# EasyEDA Pro project c4主板.epro

# Schematic Schematic2
Create Date: 2024-11-27; Page Name: P1; Project Name: C4主板优化v3.1; Schematic Name: Schematic2; Update Date: 2025-04-03; Company: 嘉立创EDA; Page Size: A4; Version: V1.0
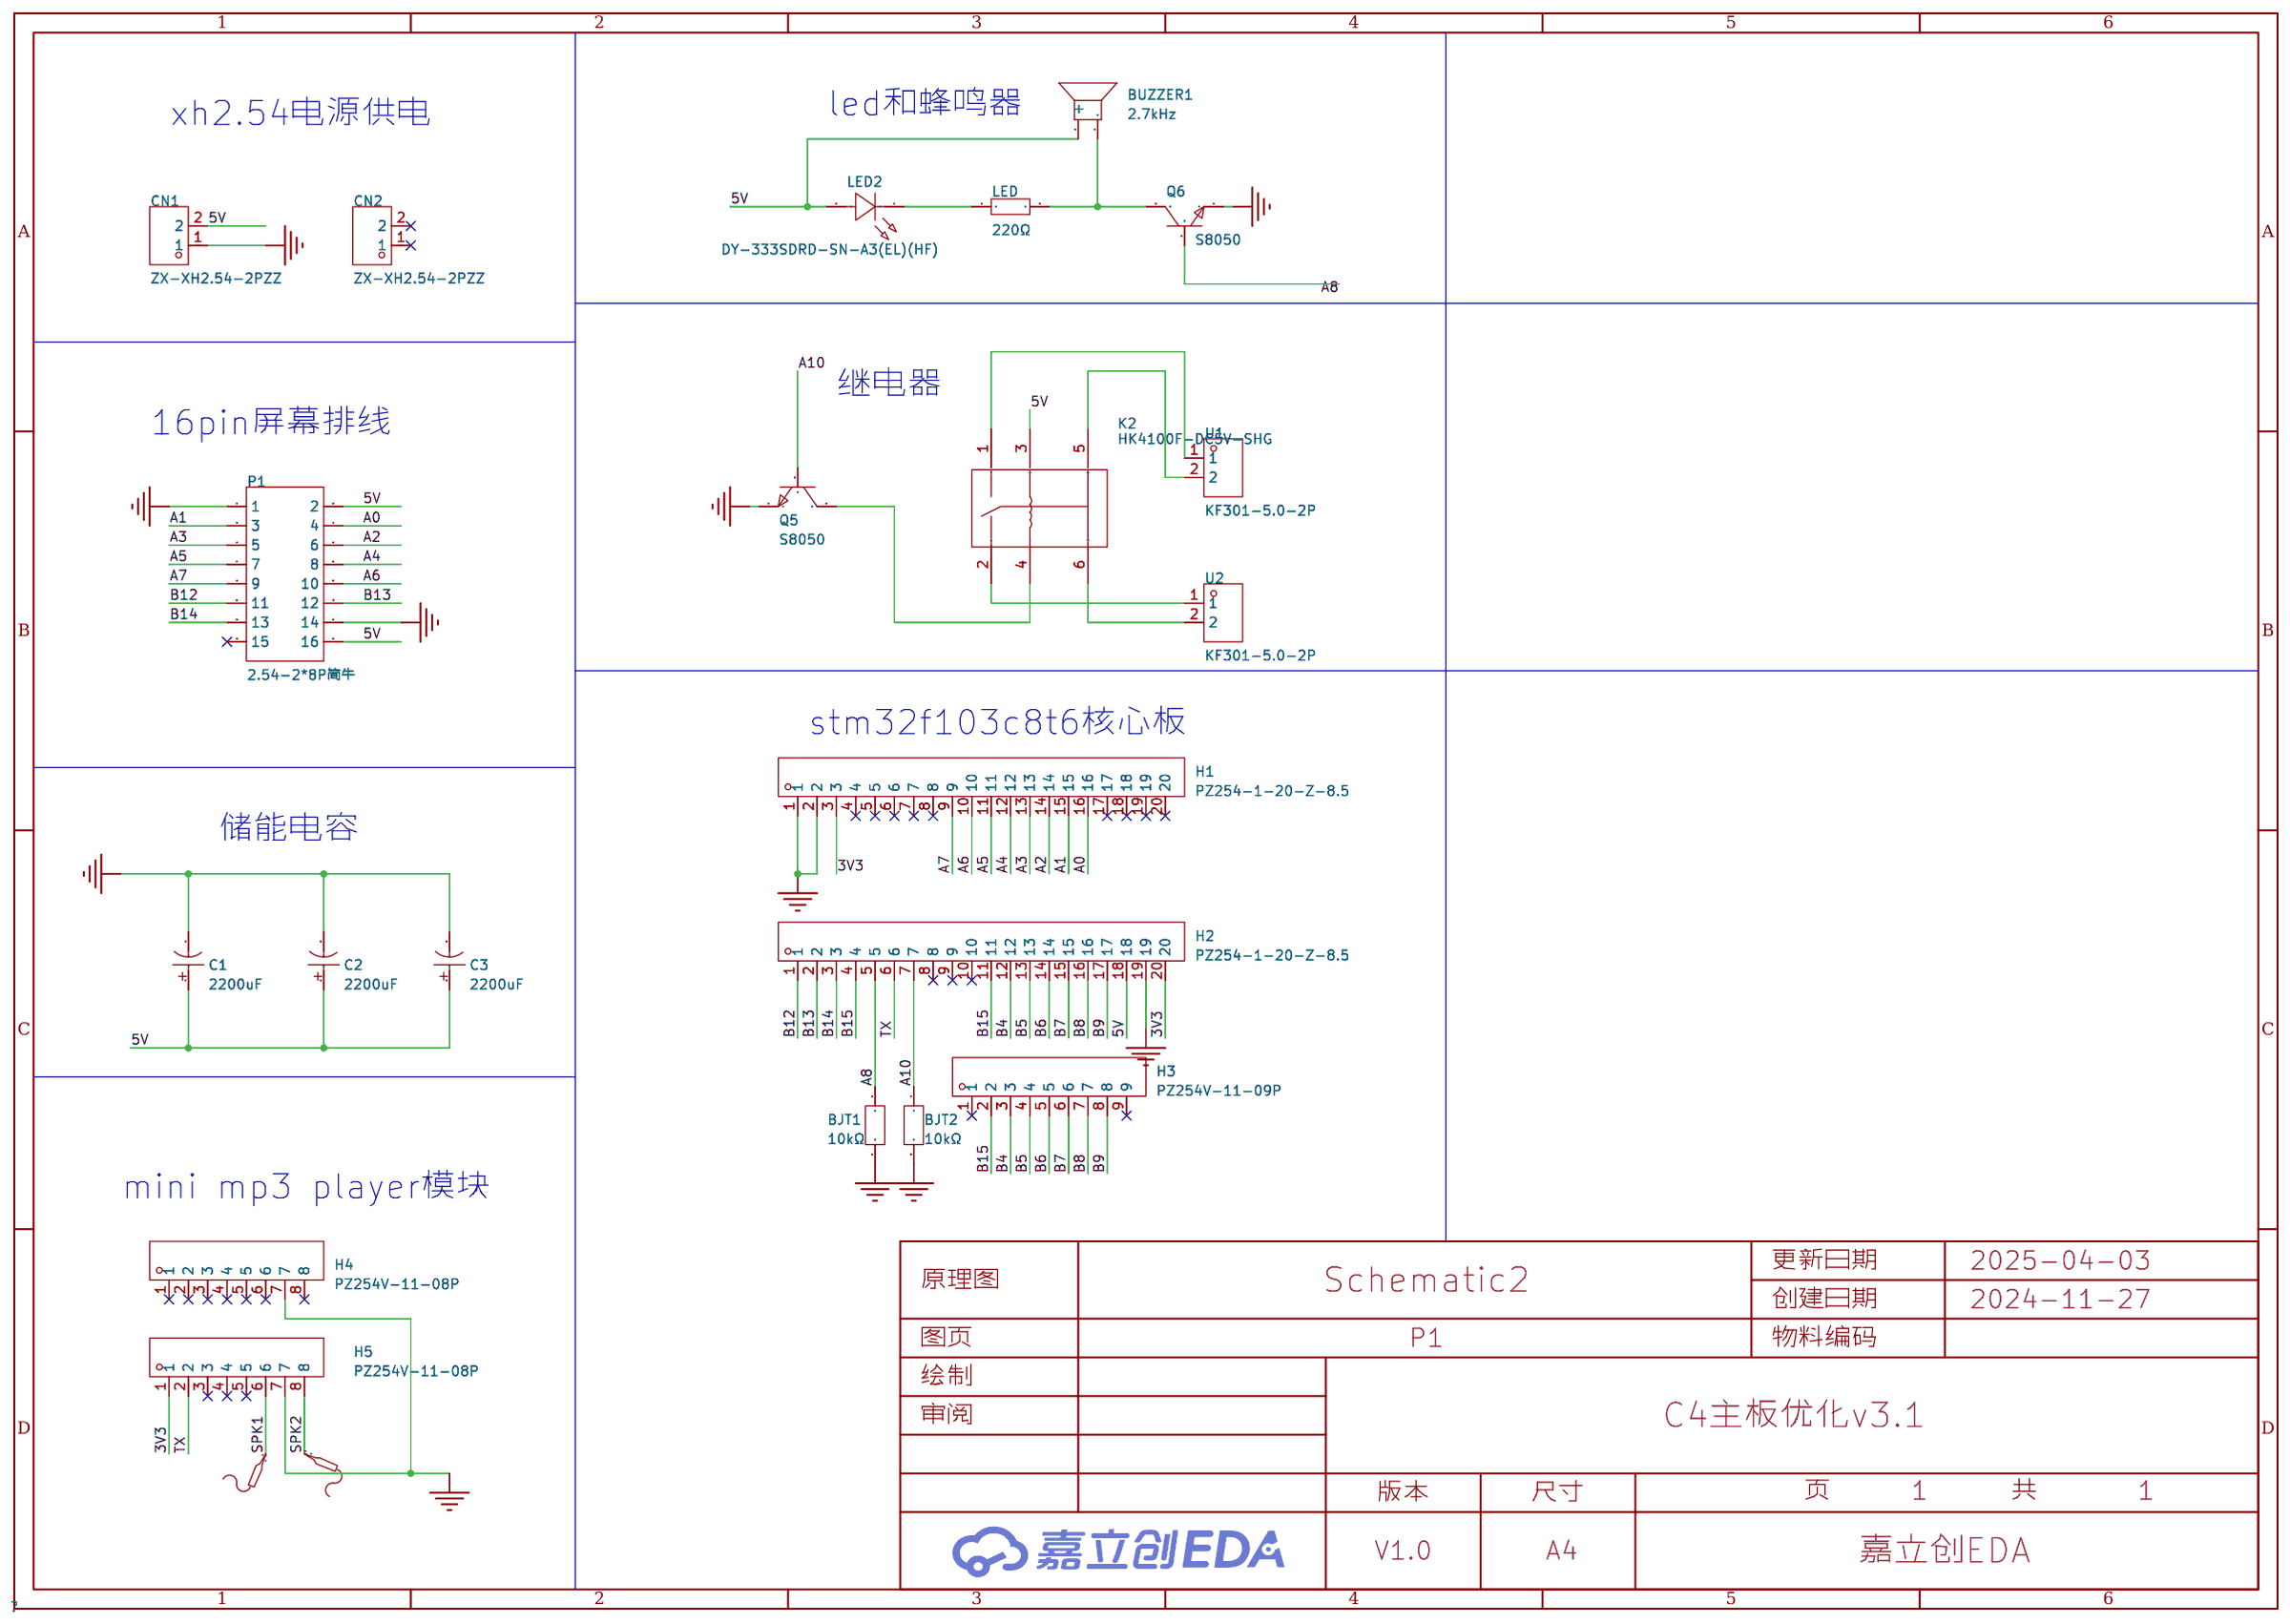
[diagram p0: schematic sheet]

## Parts
BJT1  10kΩ  [RES-TH_BD2.7-L6.2-P10.20-D0.4]
BJT2  10kΩ  [RES-TH_BD2.7-L6.2-P10.20-D0.4]
BUZZER1  2.7kHz  [BUZ-TH_BD12.0-P7.60-D0.6-FD]
C1  2200uF  [CAP-TH_BD10.0-P5.00-D1.0-FD]
C2  2200uF  [CAP-TH_BD10.0-P5.00-D1.0-FD]
C3  2200uF  [CAP-TH_BD10.0-P5.00-D1.0-FD]
CN1  ZX-XH2.54-2PZZ  [CONN-TH_2P-P2.50_HX25003-2A]
CN2  ZX-XH2.54-2PZZ  [CONN-TH_2P-P2.50_HX25003-2A]
H1  PZ254-1-20-Z-8.5  [HDR-TH_20P-P2.54-V-M]
H2  PZ254-1-20-Z-8.5  [HDR-TH_20P-P2.54-V-M]
H3  PZ254V-11-09P  [HDR-TH_9P-P2.54-V-M]
H4  PZ254V-11-08P  [HDR-TH_8P-P2.54-V-M]
H5  PZ254V-11-08P  [HDR-TH_8P-P2.54-V-M]
K2  HK4100F-DC5V-SHG  [RELAY-TH_HK4100F-DC5V-SHG]
LED  220Ω  [RES-TH_BD2.4-L6.3-P10.30-D0.6]
LED2  DY-333SDRD-SN-A3(EL)(HF)  [LED-TH_BD5.9-P2.54-RD]
P1  2.54-2*8P简牛  [IDC-TH_16P-P2.54_C3406]
Q5  S8050  [TO-92-3_L4.5-W3.5-P1.27-L]
Q6  S8050  [TO-92-3_L4.5-W3.5-P1.27-L]
SPK1  -  [Test-Point-0.5mm]
SPK2  -  [Test-Point-0.5mm]
U1  KF301-5.0-2P  [CONN-TH_P5.00_KF301-5.0-2P]
U2  KF301-5.0-2P  [CONN-TH_P5.00_KF301-5.0-2P]

## Library data of the parts
BJT1 BJT2 = MF1/4W-10K±1%-ST52: 电阻类型:金属膜电阻;阻值:10kΩ;精度:±1%;功率:250mW;温度系数:±100ppm/℃;; LCSC Part Name: 金属膜电阻 10kΩ ±1% 250mW; Supplier Part: C2903232; Manufacturer: VO(翔胜); Supplier Footprint: 插件,D2.7xL6.2mm; JLCPCB Part Class: 扩展库; Datasheet: https://atta.szlcsc.com/upload/public/pdf/source/20200609/C601728_5AA4C0C8E12E11069DA2C3356F29D1F2.pdf; Supplier: LCSC; Type: 金属膜电阻; Tolerance: ±1%; Overload Voltage (Max): 250V; Power(Watts): 250mW; Temperature Coefficient: ±100ppm/℃; Operating Temperature Range: -55℃~+155℃
BUZZER1 = TMB12A05_C96093: 驱动方式:有源(内含驱动线路);构造类型:电磁式;频率:2.7kHz;声压(SPL):85dB@5V,10cm;; LCSC Part Name: TMB12A05; Supplier Part: C96093; Manufacturer: 华能; Manufacturer Part: TMB12A05; Supplier Footprint: 插件,D=12mm; Datasheet: https://atta.szlcsc.com/upload/public/pdf/source/20230426/A4FC10532558AA232D532AB83455FBA4.pdf; Supplier: LCSC; Oscillator Circuit: 有源(内含驱动线路); Technology Type: 电磁式; Operating Voltage: 4V~8V; Sound Pressure Level (SPL): 85dB@5V,10cm; Diameter (φD): 12mm; Height: 9.8mm
C1-C3 = KM228M016G20RR0VH2FP0: 容值:2200uF;精度:±20%;额定电压:16V;纹波电流:-;等效串联电阻:-;; LCSC Part Name: 2200uF ±20% 16V; Supplier Part: C3328; Manufacturer: CX(承兴); Supplier Footprint: 插件,D10xL20mm; JLCPCB Part Class: 扩展库; Datasheet: https://atta.szlcsc.com/upload/public/pdf/source/20211027/06D6BA3719C264B639DC286D935D03EA.pdf; Supplier: LCSC; Tolerance: ±20%; Rated Voltage: 16V; Lead Spacing: 5mm; φD: 10mm; L: 20mm; Lifetime @ Temp: 2000hrs@105℃
CN1 CN2 = ZX-XH2.54-2PZZ: 插针结构:1x2P;间距:2.54mm;安装方式:直插;参考系列:XH;总PIN数:2P;排数:1;每排PIN数:2;行距:-;额定电流:3A;触头材质:黄铜;触头镀层:锡;工作温度范围:-25℃~+85℃;; Supplier Part: C7429632; Manufacturer: Megastar(兆星); Supplier Footprint: 插件,P=2.54mm; JLCPCB Part Class: 扩展库; Datasheet: https://atta.szlcsc.com/upload/public/pdf/source/20230619/19BA6947230AA44A04D3EDD65E618FD0.pdf; Supplier: LCSC; Pins Structure: 1x2P; Pitch: 2.54mm; Mounting Style: 直插; Reference Series: XH; Number of Pins: 2P; Number of Rows: 1; Number of PINs Per Row: 2; Current Rating (Max): 3A; Contact Material: 黄铜; Contact Plating: 锡; Operating Temperature Range: -25℃~+85℃
H1 H2 = PZ254-1-20-Z-8.5_C2894943: 插针结构:1x20P;间距:2.54mm;行距:-;圆针/方针:方针;安装类型:直插;排数:单排;总PIN位数:20P;额定电流:3A;额定电压:-;配合针长度:6mm;塑高:2.5mm;端接针长度:3mm;触头材质:-;工作温度范围:-40℃~+105℃;颜色:黑色;; LCSC Part Name: 间距:2.54mm 1x20P 直插 方针; Supplier Part: C2894943; Manufacturer: HCTL(华灿天禄); Supplier Footprint: 插件,P=2.54mm; Datasheet: https://atta.szlcsc.com/upload/public/pdf/source/20230609/805D25CEF03592837AF6F506EEB5ED41.pdf; Supplier: LCSC; Pin Structure: 1x20P; Pitch: 2.54mm; Circluar Pins/Square Pins: 方针; Mounting Type: 直插; Number of Rows: 单排; Number of Pins: 20P; Current Rating (Max): 3A; Length of Mating Pin: 6mm; Insulation Height: 2.5mm; Length of End Connection Pin: 3mm; Operating Temperature Range: -40℃~+105℃; Color: 黑色
H3 = PZ254V-11-09P: 插针结构:1x9P;间距:2.54mm;行距:-;圆针/方针:方针;安装类型:直插;排数:单排;总PIN位数:9P;额定电流:-;额定电压:-;配合针长度:6mm;塑高:2.5mm;端接针长度:3mm;触头材质:黄铜;触头镀层:-;工作温度范围:-40℃~+105℃;颜色:黑色;; LCSC Part Name: 间距:2.54mm 1x9P 直插 方针; Supplier Part: C492408; Manufacturer: XFCN(兴飞); Supplier Footprint: 插件,P=2.54mm; Datasheet: https://atta.szlcsc.com/upload/public/pdf/source/20200309/C492408_0CE6AEE885DD471CEFA4BE32B6482CF7.pdf; Supplier: LCSC; Pin Structure: 1x9P; Pitch: 2.54mm; Circluar Pins/Square Pins: 方针; Mounting Type: 直插; Number of Rows: 单排; Number of Pins: 9P; Length of Mating Pin: 6mm; Insulation Height: 2.5mm; Length of End Connection Pin: 3mm; Contact Material: 黄铜; Operating Temperature Range: -40℃~+105℃; Color: 黑色
H4 H5 = PZ254V-11-08P: 插针结构:1x8P;间距:2.54mm;行距:-;圆针/方针:方针;安装类型:直插;排数:单排;总PIN位数:8P;额定电流:-;额定电压:-;配合针长度:6mm;塑高:2.5mm;端接针长度:3mm;触头材质:黄铜;触头镀层:-;工作温度范围:-40℃~+105℃;颜色:黑色;; LCSC Part Name: 间距:2.54mm 1x8P 直插 方针; Supplier Part: C492407; Manufacturer: XFCN(兴飞); Supplier Footprint: 插件,P=2.54mm; JLCPCB Part Class: 扩展库; Datasheet: https://atta.szlcsc.com/upload/public/pdf/source/20200309/C492407_83A6FB26A2233368EDB9516968EC6149.pdf; Supplier: LCSC; Pin Structure: 1x8P; Pitch: 2.54mm; Circluar Pins/Square Pins: 方针; Mounting Type: 直插; Number of Rows: 单排; Number of Pins: 8P; Length of Mating Pin: 6mm; Insulation Height: 2.5mm; Length of End Connection Pin: 3mm; Contact Material: 黄铜; Operating Temperature Range: -40℃~+105℃; Color: 黑色
K2 = HK4100F-DC5V-SHG: 线圈电压:-;触点形式:-;触点容量(电阻负载):-;最大切换电压:-;最大切换电流:-;; Supplier Part: C12072; Manufacturer: 汇科; Supplier Footprint: DIP,10.5x14.5mm; Datasheet: https://atta.szlcsc.com/upload/public/pdf/source/20180316/5A66D26635AF047552DED4727B242686.pdf; Supplier: LCSC
LED = MFR-25JT-52-47R: 电阻类型:金属膜电阻;阻值:47Ω;精度:±5%;功率:250mW;; LCSC Part Name: 金属膜电阻 47Ω ±5% 250mW; Supplier Part: C176520; Manufacturer: YAGEO(国巨); Supplier Footprint: 插件,D2.4xL6.3mm; JLCPCB Part Class: 扩展库; Datasheet: https://atta.szlcsc.com/upload/public/pdf/source/20191118/C457825_18355E864DE4965678DC27B0EBC3E21E.pdf; Supplier: LCSC; Type: 金属膜电阻; Tolerance: ±5%; Power(Watts): 250mW; Operating Temperature Range: -55℃~+155℃
LED2 = DY-333SDRD-SN-A3(EL)(HF): LCSC Part Name: 5mm圆头有边深红色; Supplier Part: C7470717; Manufacturer: TONYU(东裕); Supplier Footprint: D=5mm; JLCPCB Part Class: 扩展库; Datasheet: https://atta.szlcsc.com/upload/public/pdf/source/20230726/A5026F05C18442FAA119150FE1AD85AF.pdf; Supplier: LCSC
P1 = 2.54-2*8P简牛: 连接器类型:简牛座;间距:2.54mm;结构:2x8P;封装形式:直插;行距:2.54mm;排数:2;每排PIN数:8;触头材质:-;触头镀层:-;; LCSC Part Name: 2.54mm 2x8P 排数:2 每排P数:8; Supplier Part: C3406; Manufacturer: BOOMELE(博穆精密); Supplier Footprint: 插件,P=2.54mm; JLCPCB Part Class: 扩展库; Datasheet: https://atta.szlcsc.com/upload/public/pdf/source/20131122/1457706661483.pdf; Supplier: LCSC; Connector Type: 简牛座; Pitch: 2.54mm; Structure: 2x8P; Holder Type: 直插; Row Spacing: 2.54mm; Number of Rows: 2; Pin Number in each Row: 8
Q5 Q6 = S8050_C2931492: 晶体管类型:NPN;集电极电流(Ic):500mA;集射极击穿电压(Vceo):25V;功率(Pd):625mW;直流电流增益(hFE@Ic,Vce):160@50mA,1V;; LCSC Part Name: NPN 电流:500mA 耐压:25V; Supplier Part: C2931492; Manufacturer: JSMSEMI(杰盛微); Supplier Footprint: TO-92-3; JLCPCB Part Class: 扩展库; Datasheet: https://atta.szlcsc.com/upload/public/pdf/source/20240105/D4E57AD221AC7DEA1E31B953388D993E.pdf; Supplier: LCSC; Transistor Type: NPN; Collector Current (Ic): 500mA; Collector-Emitter Breakdown Voltage (Vceo): 25V; Power Dissipation (Pd): 625mW; DC Current Gain (hFE@Ic,Vce): 160@50mA,1V; Transition Frequency (fT): 150MHz; Collector Cut-Off Current (Icbo): 100nA; Collector-Emitter Saturation Voltage (VCE(sat)@Ic,Ib): 600mV@500mA,50mA
SPK1 SPK2 = Test-Point: Test Point 测试点
U1 U2 = KF301-5.0-2P: 结构:1x2P;间距:5mm;颜色:蓝色;安装方式:直插;额定电流:17A;额定电压:250V;排数:1;线规 - AWG:14~22;线规 - 平方毫米:1.5;每排PIN数:2;工作温度范围:-30℃~+120℃;; LCSC Part Name: 5mm 1x2P 排数:1 每排P数:2 直插; Supplier Part: C474881; Manufacturer: KEFA(科发); Supplier Footprint: 插件,P=5mm; JLCPCB Part Class: 扩展库; Datasheet: https://atta.szlcsc.com/upload/public/pdf/source/20230317/03A5B5FC229D6F9225E8F51DA1A4E80A.pdf; Supplier: LCSC; Structure: 1x2P; Pitch: 5mm; Color: 蓝色; Mounting Style: 直插; Current Rating (Max): 17A; Voltage Rating (Max): 250V; Number of Pins: 2P; Number of Rows: 1; Wire Gauge - AWG: 14~22; Wire Gauge - mm2: 1.5; Number of PINs Per Row: 2; Operating Temperature Range: -30℃~+120℃

## Nets
3V3: H1.3 H2.20 H5.1
5V: BUZZER1.1(+) C1.1 C2.1 C3.1 CN1.2 H2.18 K2.3 LED2.2(A) P1.2 P1.16
GND: BJT1.2 BJT2.2 C1.2 C2.2 C3.2 CN1.1 H1.1 H1.2 H2.19 H4.7 H5.7 P1.1 P1.14 Q5.1(E) Q6.1(E)
A0: H1.16 P1.4
A1: H1.15 P1.3
A2: H1.14 P1.6
A3: H1.13 P1.5
A4: H1.12 P1.8
A5: H1.11 P1.7
A6: H1.10 P1.10
A7: H1.9 P1.9
A8: BJT1.1 H2.5 Q6.2(B)
A10: BJT2.1 H2.7 Q5.2(B)
B4: H2.12 H3.3
B5: H2.13 H3.4
B6: H2.14 H3.5
B7: H2.15 H3.6
B8: H2.16 H3.7
B9: H2.17 H3.8
B12: H2.1 P1.11
B13: H2.2 P1.12
B14: H2.3 P1.13
B15: H2.4 H2.11 H3.2
SPK1: H5.6 SPK1.1
SPK2: H5.8 SPK2.1
TX: H2.6 H5.2
$1N2473: LED.1 LED2.1(K)
$1N3753: K2.1 U1.1
$1N3786: K2.2 U2.1
$1N3790: K2.6 U2.2
$1N3801: K2.5 U1.2
$1N5791: K2.4 Q5.3(C)
$1N10812: BUZZER1.2 LED.2 Q6.3(C)

Not connected (* = marked no-connect by the designer): CN2 1* 2*; H1 4* 5* 6* 7* 8* 17* 18* 19* 20*; H2 8* 9* 10*; H3 1* 9*; H4 1* 2* 3* 4* 5* 6* 8*; H5 3* 4* 5*; P1 15*

## Notes on the sheet
- xh2.54电源供电
- led和蜂鸣器
- 继电器
- 16pin屏幕排线
- stm32f103c8t6核心板
- 储能电容
- mini mp3 player模块

# Board PCB1
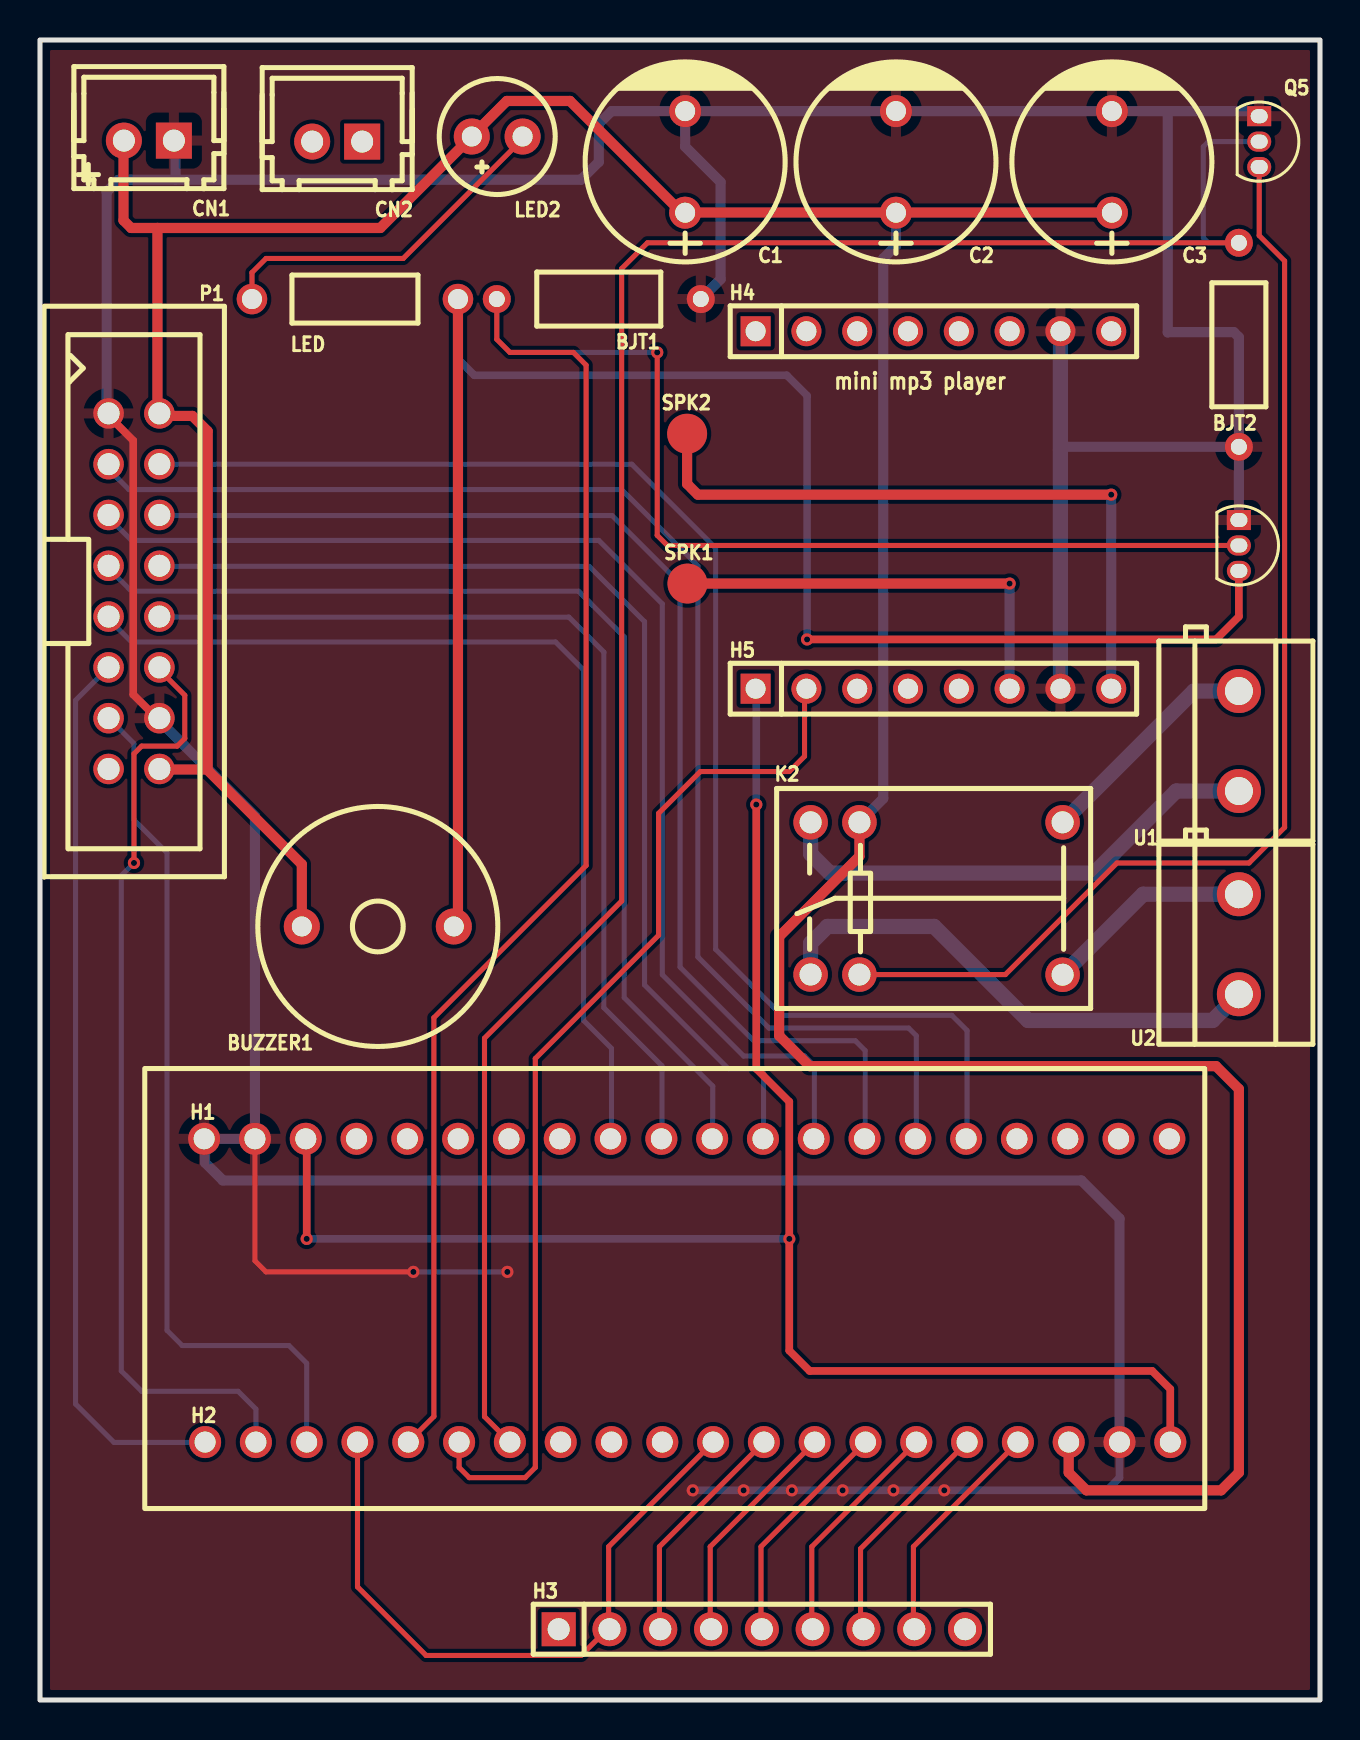
[diagram p1: board, top side]
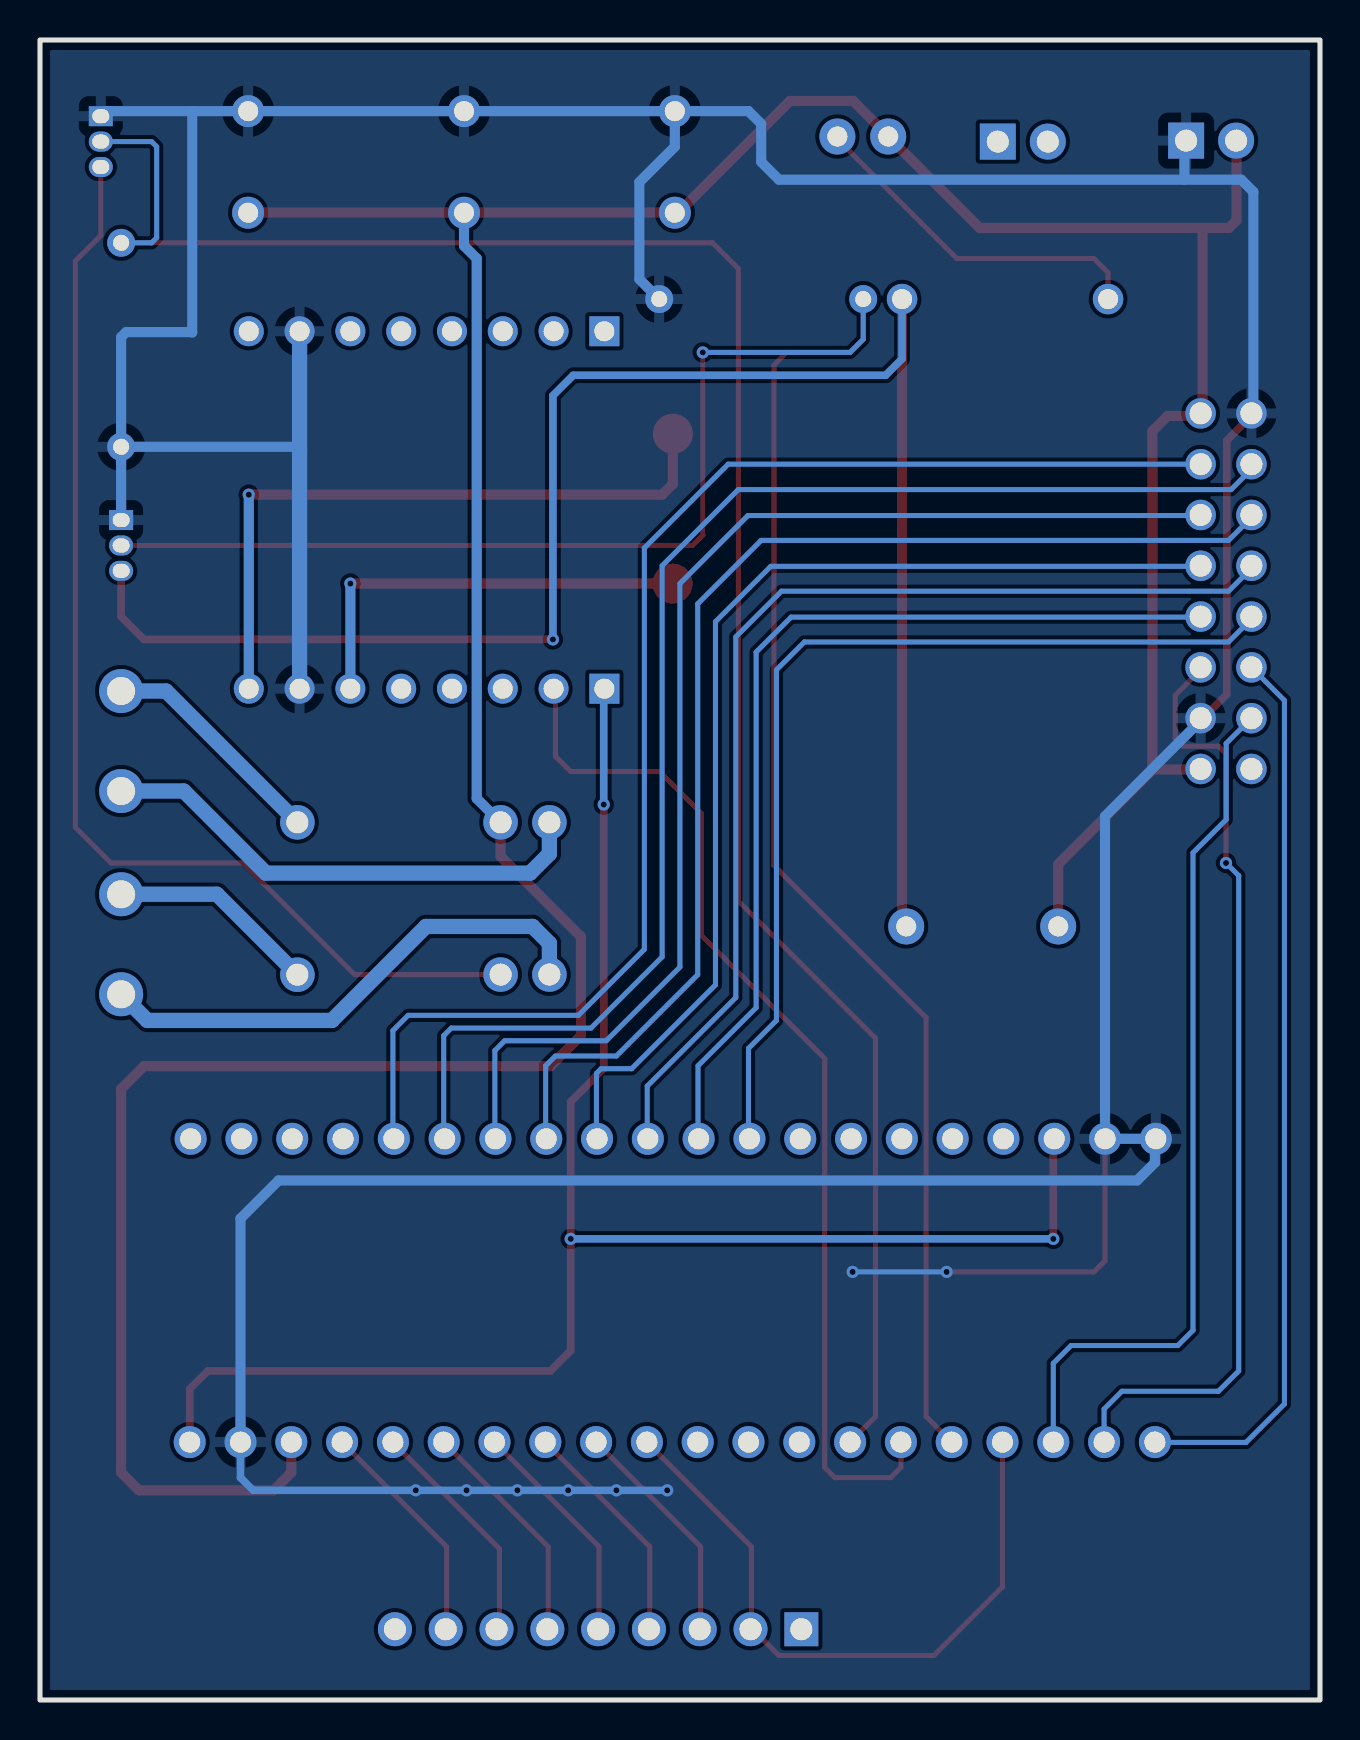
[diagram p2: board, bottom side, seen from below]

Outline 64 x 83 mm; copper layers: Top Layer, Bottom Layer. Coordinates in mm from the lower left corner of the outline.
Outline path: rectangle 0,83 64,0
Stack: Top Layer 0.035mm / Dielectric1 1.51mm FR4 er 4.5 / Bottom Layer 0.035mm

## Design rules (mm)
template: 自定义配置
spacing copperThickness1oz (default): track to track 0.203, other pairs 0.203 to 0.203
spacing copperThickness2oz: track to track 0.203, other pairs 0.152 to 0.3
track width copperThickness1oz (default): min 0.127, default 0.254, max 2.54
track width copperThickness2oz: min 0.203, default 0.254, max 2.54
differential pair differentialPair (default): width min 0.127, default 0.254, max 2.54; gap min 0.152, default 0.152
via viaSize (default): diameter min 0.5, default 0.61, max 10; hole min 0.3, default 0.305, max 6.299

## Placement (name value [footprint] x y rotation side)
BJT1  10kΩ  [RES-TH_BD2.7-L6.2-P10.20-D0.4]  27.94 70.05 0 top
BJT2  10kΩ  [RES-TH_BD2.7-L6.2-P10.20-D0.4]  59.94 67.76 270 top
BUZZER1  2.7kHz  [BUZ-TH_BD12.0-P7.60-D0.6-FD]  16.89 38.68 0 top
C1  2200uF  [CAP-TH_BD10.0-P5.00-D1.0-FD]  32.26 76.9 90 top
C2  2200uF  [CAP-TH_BD10.0-P5.00-D1.0-FD]  42.8 76.9 90 top
C3  2200uF  [CAP-TH_BD10.0-P5.00-D1.0-FD]  53.59 76.9 90 top
CN1  ZX-XH2.54-2PZZ  [CONN-TH_2P-P2.50_HX25003-2A]  5.44 77.97 180 top
CN2  ZX-XH2.54-2PZZ  [CONN-TH_2P-P2.50_HX25003-2A]  14.86 77.92 180 top
H1  PZ254-1-20-Z-8.5  [HDR-TH_20P-P2.54-V-M]  32.34 28.06 0 top
H2  PZ254-1-20-Z-8.5  [HDR-TH_20P-P2.54-V-M]  32.38 12.9 0 top
H3  PZ254V-11-09P  [HDR-TH_9P-P2.54-V-M]  36.09 3.54 0 top
H4  PZ254V-11-08P  [HDR-TH_8P-P2.54-V-M]  44.67 68.44 0 top
H5  PZ254V-11-08P  [HDR-TH_8P-P2.54-V-M]  44.67 50.56 0 top
K2  HK4100F-DC5V-SHG  [RELAY-TH_HK4100F-DC5V-SHG]  44.83 40.07 0 top
LED  220Ω  [RES-TH_BD2.4-L6.3-P10.30-D0.6]  15.75 70.05 0 top
LED2  DY-333SDRD-SN-A3(EL)(HF)  [LED-TH_BD5.9-P2.54-RD]  22.86 78.17 180 top
P1  2.54-2*8P简牛  [IDC-TH_16P-P2.54_C3406]  4.7 55.44 270 top
Q5  S8050  [TO-92-3_L4.5-W3.5-P1.27-L]  60.96 77.92 270 top
Q6  S8050  [TO-92-3_L4.5-W3.5-P1.27-L]  59.94 57.73 270 top
SPK1  -  [test-point-0.5mm]  32.37 55.82 0 top
SPK2  -  [test-point-0.5mm]  32.36 63.31 0 top
U1  KF301-5.0-2P  [CONN-TH_P5.00_KF301-5.0-2P]  59.94 47.95 90 top
U2  KF301-5.0-2P  [CONN-TH_P5.00_KF301-5.0-2P]  59.94 37.79 90 top

## Footprints (pads in the part's own frame, mm; a bottom-side part is the same pattern mirrored in y, then rotated)
BUZ-TH_BD12.0-P7.60-D0.6-FD
  round 1.8 hole 1: 1(-3.8,0) 2(3.8,0)
CAP-TH_BD10.0-P5.00-D1.0-FD
  round 1.6 hole 1: 1(-2.54,0) 2(2.54,0)
CONN-TH_2P-P2.50_HX25003-2A
  rect 1.8x1.8 hole 1.1: 1(-1.25,0)
  round 1.8 hole 1.1: 2(1.25,0)
CONN-TH_P5.00_KF301-5.0-2P
  round 2.2 hole 1.4: 1(-2.5,0) 2(2.5,0)
HDR-TH_8P-P2.54-V-M
  rect 1.5x1.5 hole 1: 1(-8.89,0)
  round 1.5 hole 1: 2(-6.35,0) 3(-3.81,0) 4(-1.27,0) 5(1.27,0) 6(3.81,0) 7(6.35,0) 8(8.89,0)
HDR-TH_9P-P2.54-V-M
  rect 1.7x1.7 hole 1.1: 1(-10.16,0)
  round 1.7 hole 1.1: 2(-7.62,0) 3(-5.08,0) 4(-2.54,0) 5(0,0) 6(2.54,0) 7(5.08,0) 8(7.62,0) 9(10.16,0)
HDR-TH_20P-P2.54-V-M
  round 1.6 hole 1.05: 1(-24.13,0) 2(-21.59,0) 3(-19.05,0) 4(-16.51,0) 5(-13.97,0) 6(-11.43,0) 7(-8.89,0) 8(-6.35,0) 9(-3.81,0) 10(-1.27,0) 11(1.27,0) 12(3.81,0) 13(6.35,0) 14(8.89,0) 15(11.43,0) 16(13.97,0) 17(16.51,0) 18(19.05,0) 19(21.59,0) 20(24.13,0)
IDC-TH_16P-P2.54_C3406
  round 1.524 hole 1.1: 1(-8.89,-1.27) 2(-8.89,1.27) 3(-6.35,-1.27) 4(-6.35,1.27) 5(-3.81,-1.27) 6(-3.81,1.27) 7(-1.27,-1.27) 8(-1.27,1.27) 9(1.27,-1.27) 10(1.27,1.27) 11(3.81,-1.27) 12(3.81,1.27) 13(6.35,-1.27) 14(6.35,1.27) 15(8.89,-1.27) 16(8.89,1.27)
LED-TH_BD5.9-P2.54-RD
  round 1.8 hole 1: 1(-1.27,0) 2(1.27,0)
RELAY-TH_HK4100F-DC5V-SHG
  round 1.727 hole 1.1: 1(-6.301,3.81) 2(-6.301,-3.8) 3(-3.86,3.81) 4(-3.86,-3.803) 5(6.301,3.81) 6(6.301,-3.81)
RES-TH_BD2.4-L6.3-P10.30-D0.6
  round 1.524 hole 1: 1(-5.15,0) 2(5.15,0)
RES-TH_BD2.7-L6.2-P10.20-D0.4
  round 1.4 hole 0.8: 1(-5.1,0) 2(5.1,0)
test-point-0.5mm
  round 2 smd: 1(0,0)
TO-92-3_L4.5-W3.5-P1.27-L
  rect 1x1.2 hole 0.7x0.85: 1(-1.27,0)
  oval 1x1.2 hole 0.7x0.85: 2(0,0) 3(1.27,0)

## Nets
As in the schematic.

Pads without a net: CN2 1 2; H1 4 5 6 7 8 17 18 19 20; H2 8 9 10; H3 1 9; H4 1 2 3 4 5 6 8; H5 3 4 5; P1 15

## Via types
v1: diameter 0.61, hole 0.305, Top Layer to Bottom Layer, 16 vias

## Routing (per net, layer and track width the routed paths; a pad name or vN(x,y) marks a point on that pad's centre or on a via; arc(x,y) is an arc through that point)
3V3: length 85.5
  Top Layer w0.381: H2.20 56.51,15.55 55.61,16.45 38.48,16.45 37.47,17.47 v1(37.47,23.06) 37.45,23.06 37.47,23.07 37.47,29.91 35.81,31.56 v1(35.81,44.77) ; v1(13.34,23.06) 13.34,28.01 H1.3
  Bottom Layer w0.381: H5.1 35.81,50.53 v1(35.81,44.77) ; v1(37.47,23.06) v1(13.34,23.06)
5V: length 197.7
  Top Layer w0.381: 5.84,46.68 6,46.52 5.87,46.52
  Top Layer w0.508: 5.87,73.6 17.02,73.6 21.4,77.98 21.4,78.01 23.34,79.95 26.5,79.95 32.08,74.37 53.57,74.37 ; 5.87,73.6 4.56,73.6 4.17,73.98 4.17,77.87 ; 5.87,73.6 5.87,64.3 5.97,64.2 7.62,64.2 8.38,63.44 8.38,46.55 8.35,46.52 ; 13.09,38.68 13.09,41.79 8.35,46.52 ; 8.35,46.52 6,46.52 ; K2.3 40.97,42.18 36.96,38.17 36.96,33.22 38.48,31.69 58.8,31.69 59.94,30.55 59.94,11.37 59.06,10.48 52.32,10.48 51.44,11.37 H2.18
  Bottom Layer w0.508: 42.67,74.36 42.8,74.24 42.8,72.71 42.16,72.08 42.16,45.08 K2.3
GND: length 278.2
  Top Layer w0.254: H1.2 10.75,21.96 11.3,21.41 v1(18.67,21.41)
  Top Layer w0.381: 3.33,64.3 4.66,62.97 4.66,50.27 5.87,49.06
  Bottom Layer w0.254: v1(23.37,21.41) v1(18.67,21.41)
  Bottom Layer w0.381: H1.2 10.78,28.06 ; 53.96,12.87 53.97,12.86 53.97,11.12 53.34,10.48 v1(45.21,10.48) v1(42.67,10.48) v1(40.13,10.48) v1(37.59,10.48) v1(35.18,10.48) v1(32.64,10.48)
  Bottom Layer w0.508: 8.25,28.06 8.25,26.87 9.14,25.98 52.07,25.98 53.97,24.07 53.97,12.89 53.96,12.87 ; 8.25,28.06 H1.1 ; 8.25,28.06 H1.2 ; 6.78,76.02 27.05,76.02 27.94,76.9 27.94,78.81 28.57,79.44 C1.2 ; 6.78,76.02 3.94,76.02 3.33,75.41 3.33,64.3 ; 6.78,76.02 6.78,77.87 ; 56.39,79.44 56.39,68.38 56.4,68.39 59.69,68.39 59.94,68.14 BJT2.2 ; 56.39,79.44 C3.2 C2.2 C1.2 ; 56.39,79.44 60.71,79.44 Q5.1 ; C1.2 32.26,77.67 34.03,75.89 34.03,71.04 BJT1.2 ; BJT2.2 51.17,62.66 51.02,62.51 ; BJT2.2 Q6.1 ; 10.75,28.11 10.75,44.19 5.87,49.06
  Bottom Layer w0.762: H5.7 H4.7
(no net): length 0.1
  Bottom Layer w0.381: 16.08,77.87 16.13,77.82
A0: length 69
  Bottom Layer w0.254: 6.23,61.79 29.59,61.79 33.78,57.6 33.78,37.53 37.08,34.23 45.59,34.23 46.35,33.47 46.35,28.13 46.34,28.11
A1: length 69
  Bottom Layer w0.254: 43.8,28.11 43.81,28.13 43.81,33.22 43.43,33.6 36.45,33.6 32.89,37.15 32.89,56.71 29.08,60.52 4.44,60.52 3.2,61.76
A2: length 61.7
  Bottom Layer w0.254: 6.25,59.22 28.6,59.22 32,55.82 32,36.64 35.69,32.96 40.77,32.96 41.26,32.47 41.26,28.11
A3: length 61.2
  Bottom Layer w0.254: 38.72,28.11 38.72,31.71 38.23,32.2 35.18,32.2 31.12,36.26 31.12,54.81 27.94,57.98 4.57,57.98 3.33,59.22
A4: length 54.3
  Bottom Layer w0.254: 6.25,56.68 27.46,56.68 30.23,53.92 30.23,35.76 34.42,31.56 35.94,31.56 36.18,31.33 36.18,28.11
A5: length 54.2
  Bottom Layer w0.254: 33.64,28.11 33.64,30.69 29.21,35.12 29.21,53.16 26.92,55.44 4.57,55.44 3.33,56.68
A6: length 48.5
  Bottom Layer w0.254: 5.87,54.14 26.44,54.14 28.19,52.39 28.19,34.61 31.1,31.71 31.1,28.11
A7: length 48.9
  Bottom Layer w0.254: 28.56,28.11 28.57,28.13 28.57,32.58 27.18,33.98 27.18,51.5 25.78,52.9 4.58,52.9 3.33,54.14
A8: length 113.3
  Top Layer w0.254: BJT1.1 22.84,68.03 23.5,67.38 26.67,67.38 27.31,66.74 27.31,41.72 19.69,34.11 19.69,14.18 H2.5 ; v1(30.86,67.38) 30.86,58.23 31.37,57.73 Q6.2
  Bottom Layer w0.254: BJT1.1 22.84,68.03 23.5,67.38 v1(30.86,67.38)
A10: length 102.8
  Top Layer w0.254: H2.7 22.22,14.17 22.22,33.09 29.08,39.95 29.08,71.57 30.37,72.86 BJT2.1
  Bottom Layer w0.254: Q5.2 58.42,77.92 58.17,77.67 58.17,73.11 58.42,72.86 BJT2.1
B4: length 11.4
  Top Layer w0.254: 30.97,3.6 30.97,7.67 36.18,12.87
B5: length 11.4
  Top Layer w0.254: 33.51,3.6 33.51,7.67 38.72,12.87
B6: length 11.4
  Top Layer w0.254: 41.26,12.87 36.05,7.67 36.05,3.6
B7: length 11.4
  Top Layer w0.254: 38.59,3.6 38.59,7.67 43.8,12.87
B8: length 11.4
  Top Layer w0.254: 46.34,12.87 41.03,7.56 41.03,3.62
B9: length 11.4
  Top Layer w0.254: 43.67,3.6 43.67,7.67 48.88,12.87
B12: length 44.8
  Bottom Layer w0.254: P1.11 1.78,49.98 1.78,14.8 3.7,12.88 8.24,12.88 H2.1
B13: length 47.3
  Top Layer w0.254: 5.87,51.6 7.24,50.24 7.24,48.08 6.86,47.69 5.08,47.69 4.7,47.31 v1(4.7,41.85)
  Bottom Layer w0.254: 10.78,12.87 10.79,12.89 10.79,14.55 9.91,15.44 5.08,15.44 4.06,16.45 4.06,41.22 v1(4.7,41.85)
B14: length 43.5
  Bottom Layer w0.254: 13.32,12.87 13.34,12.89 13.34,16.83 12.45,17.72 7.11,17.72 6.35,18.48 6.35,42.36 4.69,44.02 4.69,47.83 P1.13
B15: length 33.2
  Top Layer w0.254: 15.86,12.87 15.88,12.86 15.88,5.66 19.3,2.23 27.06,2.23 28.43,3.6 28.43,7.67 33.64,12.87
SPK1: length 21.4
  Top Layer w0.508: v1(48.48,55.82) 32.37,55.82
  Bottom Layer w0.508: H5.6 v1(48.48,55.82)
SPK2: length 33.6
  Top Layer w0.508: v1(53.56,60.27) 32.89,60.27 32.36,60.8 SPK2.1
  Bottom Layer w0.508: H5.8 v1(53.56,60.27)
TX: length 52.4
  Top Layer w0.254: 38.32,50.31 38.23,50.22 38.23,47.19 37.47,46.42 33.02,46.42 30.93,44.33 30.93,38.24 24.76,32.07 24.76,11.63 24.26,11.12 21.46,11.12 20.96,11.63 20.96,12.9
$1N2473: length 17.7
  Top Layer w0.254: 24.06,78.14 24.06,77.98 18.16,72.08 11.3,72.08 10.6,71.37 LED.1
$1N3753: length 25.1
  Bottom Layer w0.762: U1.1 56.81,45.45 52.71,41.34 39.5,41.34 38.53,42.31 K2.1
$1N3786: length 25.8
  Bottom Layer w0.762: U2.1 58.63,33.98 49.4,33.98 44.7,38.68 39.37,38.68 38.53,37.84 K2.2
$1N3790: length 10.5
  Bottom Layer w0.762: U2.2 55.16,40.29 K2.6
$1N3801: length 11.5
  Bottom Layer w0.762: K2.5 57.7,50.45 U1.2
$1N5791: length 57.9
  Top Layer w0.254: K2.4 48.27,36.27 53.85,41.85 60.45,41.85 62.23,43.63 62.23,71.95 60.96,73.22 Q5.3
$1N10812: length 89.2
  Top Layer w0.381: v1(38.35,53.03) 58.8,53.03 59.94,54.17 59.94,56.46
  Top Layer w0.508: BUZZER1.2 20.9,38.88 LED.2
  Bottom Layer w0.381: v1(38.35,53.03) 38.35,65.22 37.34,66.24 21.72,66.24 20.9,67.06 LED.2

## Copper pours and planes (outline as drawn; the poured copper is in the pictures)
GND on Top Layer: -4.19,86.3 66.8,86.3 66.8,-2.85 -4.19,-2.85
GND on Bottom Layer: -4.19,86.43 66.93,86.43 66.93,-2.6 -4.19,-2.6

## Text on the board
Top Silkscreen Layer: mini mp3 player
